# EAGLE design beemos-master (EAGLE 8.7.1)
DELETE: MF
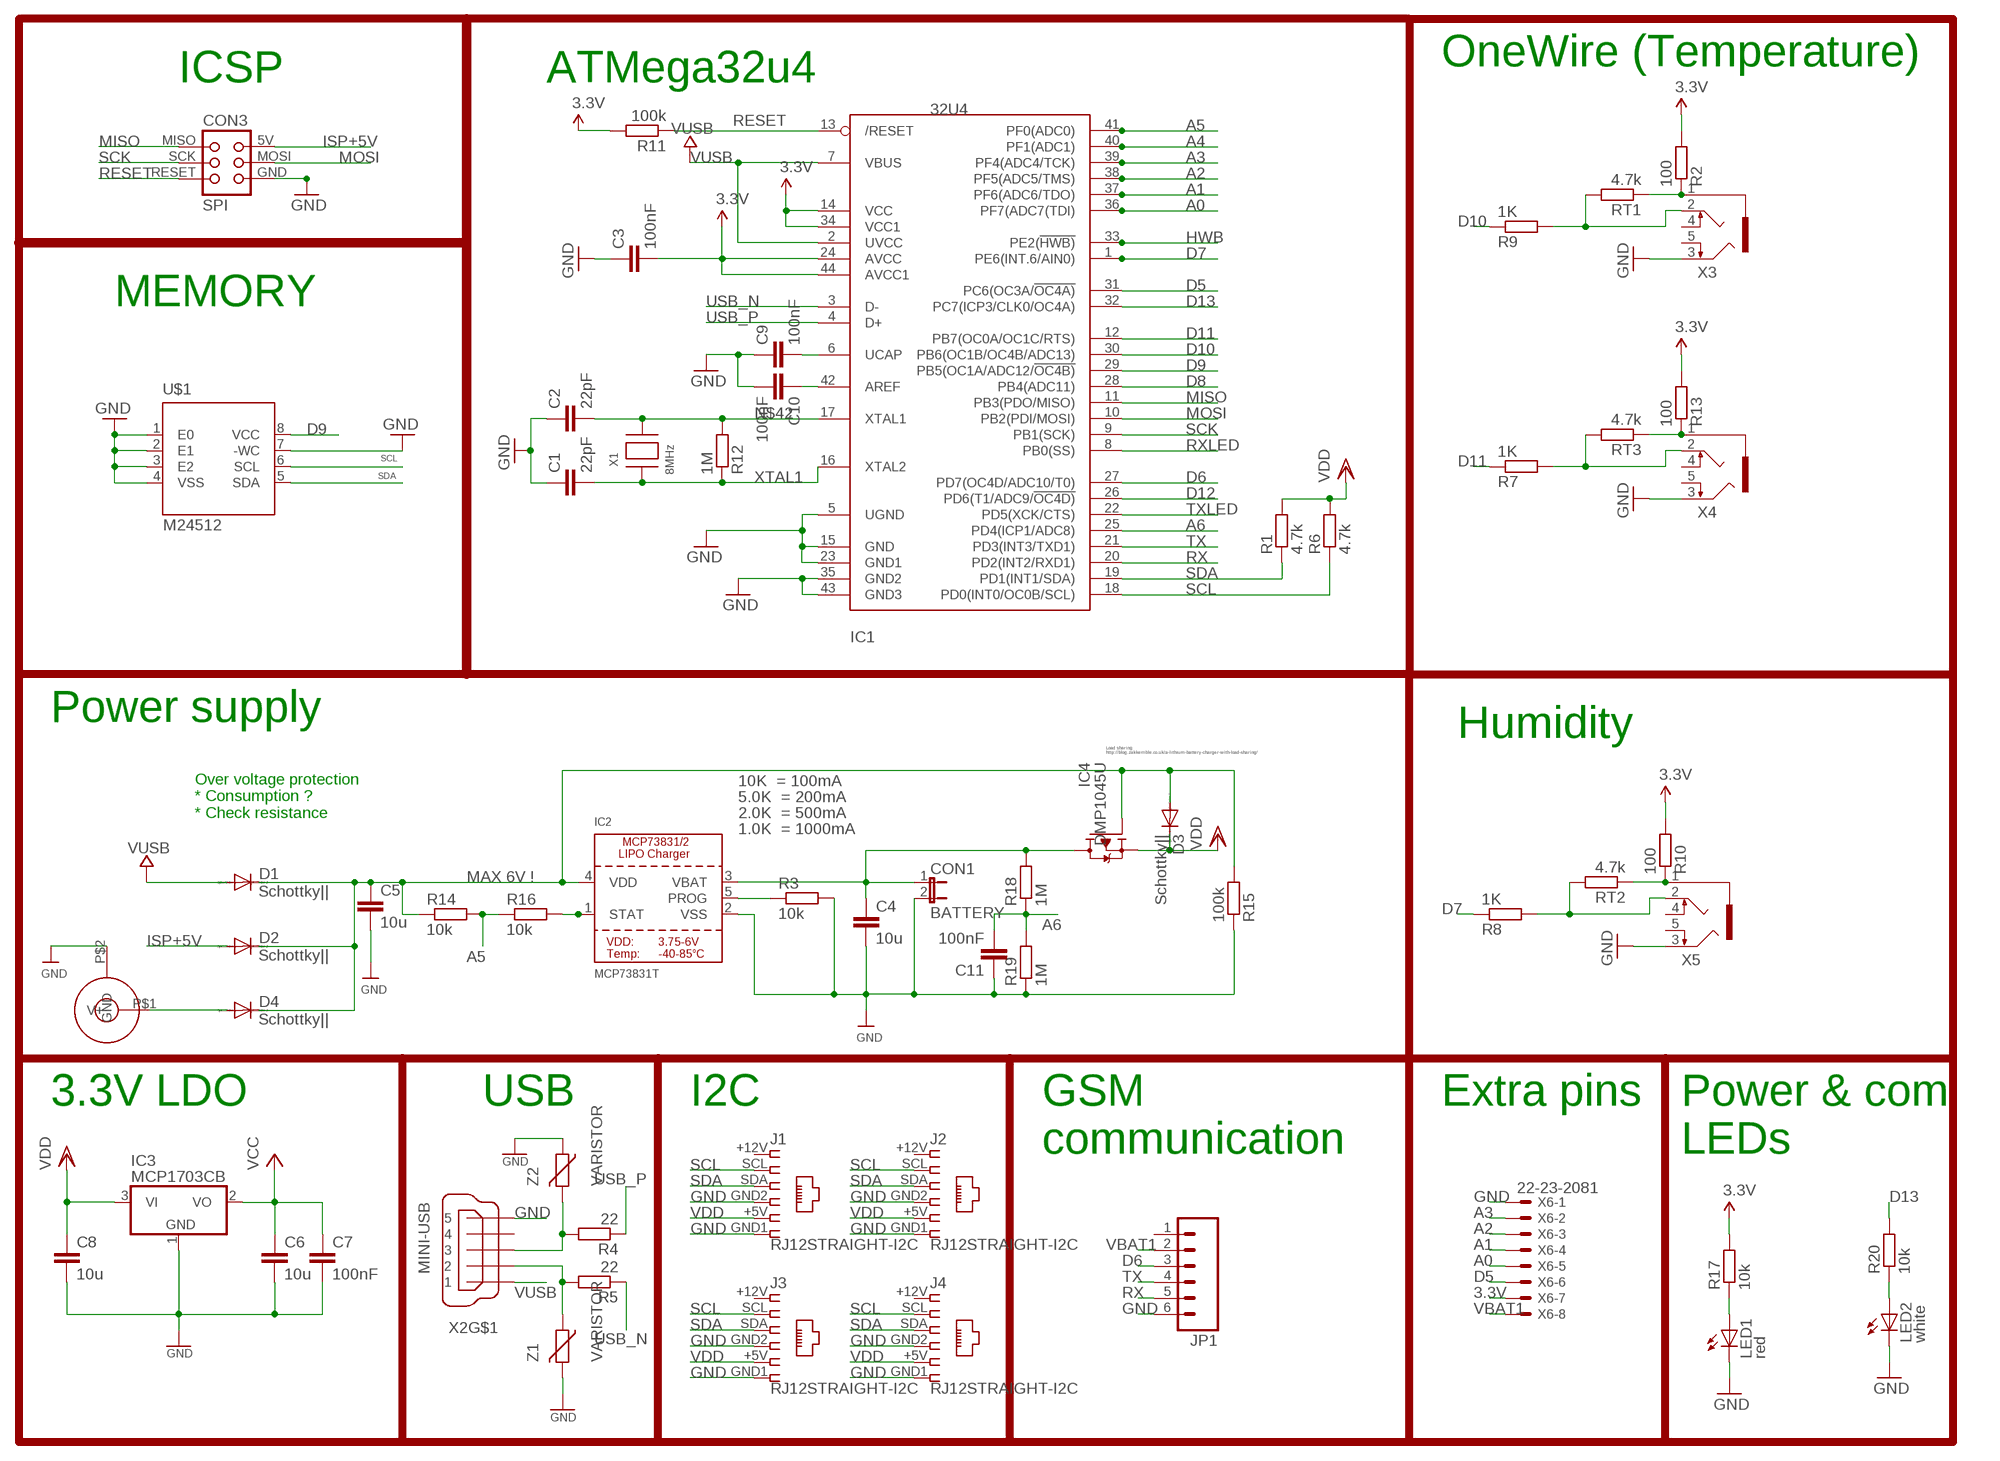
[diagram p0: schematic, sheet 1]

## Parts
C1  22pF  C-EUC0805K  [C0805K]
C2  22pF  C-EUC0805K  [C0805K]
C3  100nF  C-EUC0805K  [C0805K]
C4  10u  C-EUC0805K  [C0805K]
C5  10u  C-EUC0805K  [C0805K]
C6  10u  C-EUC0805K  [C0805K]
C7  100nF  C-EUC0805K  [C0805K]
C8  10u  C-EUC0805K  [C0805K]
C9  100nF  C-EUC0805K  [C0805K]
C10  100nF  C-EUC0805K  [C0805K]
C11  100nF  C-EUC0805K  [C0805K]
CON1  BATTERY  JP1E  [JP1]
CON2  JACK_DC_BARREL  [DC_BARREL]
CON3  SPI  TINYISPT  [TC2030-MCP-NL]
D1  Schottky||  MBR0520LT  [SOD123]
D2  Schottky||  MBR0520LT  [SOD123]
D3  Schottky||  MBR0520LT  [SOD123]
D4  Schottky||  MBR0520LT  [SOD123]
IC1  32U4  ATMEGA32U4-AU  [TQFP44]
IC2  MCP73831T  MCP73831/2  [SOT23-5]
IC3  MCP1703CB  [SOT23]
IC4  DMP1045U  TRANSISTOR_FET_TSM2301CX  [SOT-23]
J1  RJ12STRAIGHT-I2C  [RJ12-STRAIGHT-I2C]
J2  RJ12STRAIGHT-I2C  [RJ12-STRAIGHT-I2C]
J3  RJ12STRAIGHT-I2C  [RJ12-STRAIGHT-I2C]
J4  RJ12STRAIGHT-I2C  [RJ12-STRAIGHT-I2C]
JP1  M06RA  [MOLEX-1X6-RA]
LED1  red  LEDCHIP-LED0805  [CHIP-LED0805]
LED2  white  LEDCHIP-LED0805  [CHIP-LED0805]
R1  4.7k  R-EU_R0805  [R0805]
R2  100  R-EU_R0805  [R0805]
R3  10k  R-EU_R0805  [R0805]
R4  22  R-EU_R0805  [R0805]
R5  22  R-EU_R0805  [R0805]
R6  4.7k  R-EU_R0805  [R0805]
R7  1K  R-EU_R0805  [R0805]
R8  1K  R-EU_R0805  [R0805]
R9  1K  R-EU_R0805  [R0805]
R10  100  R-EU_R0805  [R0805]
R11  100k  R-EU_R0805  [R0805]
R12  1M  R-EU_R0805  [R0805]
R13  100  R-EU_R0805  [R0805]
R14  10k  R-EU_R0805  [R0805]
R15  100k  R-EU_R0805  [R0805]
R16  10k  R-EU_R0805  [R0805]
R17  10k  R-EU_R0805  [R0805]
R18  1M  R-EU_R0805  [R0805]
R19  1M  R-EU_R0805  [R0805]
R20  10k  R-EU_R0805  [R0805]
RT1  4.7k  R-EU_R0805  [R0805]
RT2  4.7k  R-EU_R0805  [R0805]
RT3  4.7k  R-EU_R0805  [R0805]
U$1  M24512  [SO8]
X1  8MHz  XTALNX6035  [NX6035]
X2  MINI-USB  MINI-USB-SCHIELD-32005-201  [32005-201]
X3  1503_09  [1503_09]
X4  1503_09  [1503_09]
X5  1503_09  [1503_09]
X6  22-23-2081  [22-23-2081]
Z1  VARISTOR  VARISTORCN0805  [CT/CN0805]
Z2  VARISTOR  VARISTORCN0805  [CT/CN0805]

## Nets
3.3V [power]: C3.2 C6.1 C7.1 IC1.14(VCC) IC1.24(AVCC) IC1.34(VCC1) IC1.44(AVCC1) IC3.2(VO) R2.2 R10.2 R11.2 R13.2 R17.2 X6.7 ; supply symbol labelled VCC
A0: IC1.36(PF7(ADC7(TDI)) X6.5
A1: IC1.37(PF6(ADC6/TDO)) X6.4
A2: IC1.38(PF5(ADC5/TMS)) X6.3
A3: IC1.39(PF4(ADC4/TCK)) X6.2
A4: IC1.40(PF1(ADC1))
A5: IC1.41(PF0(ADC0)) R14.2 R16.1
A6: C11.2 IC1.25(PD4(ICP1/ADC8)) R18.1 R19.2
AREF: C10.1 IC1.42(AREF)
D5: IC1.31(PC6(OC3A/!OC4A)) X6.6
D6: IC1.27(PD7(OC4D/ADC10/T0)) JP1.3
D7: IC1.1(PE6(INT.6/AIN0)) R8.1
D8: IC1.28(PB4(ADC11))
D9: IC1.29(PB5(OC1A/ADC12/!OC4B)) U$1.8(VCC)
D10: IC1.30(PB6(OC1B/OC4B/ADC13)) R9.1
D11: IC1.12(PB7(OC0A/OC1C/RTS)) R7.1
D12: IC1.26(PD6(T1/ADC9/!OC4D))
D13: IC1.32(PC7(ICP3/CLK0/OC4A)) R20.2
GND [power]: C1.1 C2.1 C3.1 C4.2 C5.2 C6.2 C7.2 C8.2 C9.1 C10.2 C11.1 CON1.2 CON2.P$2(GND) CON3.GND IC1.5(UGND) IC1.15(GND) IC1.23(GND1) IC1.35(GND2) IC1.43(GND3) IC2.2(VSS) IC3.1(GND) J1.GND1 J1.GND2 J2.GND1 J2.GND2 J3.GND1 J3.GND2 J4.GND1 J4.GND2 JP1.6 LED1.C LED2.C R3.2 R15.1 R19.1 U$1.1(E0) U$1.2(E1) U$1.3(E2) U$1.4(VSS) U$1.7(-WC) X2.5 X3.3 X4.3 X5.3 X6.1 Z1.2 Z2.1
HWB: IC1.33(PE2(!HWB))
ISP+5V: CON3.5V(VCC) D2.A
MISO: CON3.MISO IC1.11(PB3(PDO/MISO))
MOSI: CON3.MOSI IC1.10(PB2(PDI/MOSI))
N$1: C9.2 IC1.6(UCAP)
N$2 [power]: R7.2 RT3.2 X4.2
N$3: CON2.P$1(V+) D4.A
N$4 [power]: R13.1 RT3.1 X4.1
N$5: C5.1 D1.C D2.C D3.A D4.C IC2.4(VDD) IC4.1(G) R14.1 R15.2
N$6: IC2.5(PROG) R3.1
N$7: IC2.1(STAT) R16.2
N$8 [power]: R8.2 RT2.2 X5.2
N$9 [power]: R10.1 RT2.1 X5.1
N$10: LED1.A R17.1
N$11: LED2.A R20.1
N$14 [power]: R2.1 RT1.1 X3.1
N$21 [power]: R9.2 RT1.2 X3.2
N$42: C2.2 IC1.17(XTAL1) R12.2 X1.P$2
RESET: CON3.RESET IC1.13(/RESET) R11.1
RX: IC1.20(PD2(INT2/RXD1)) JP1.5
RXLED: IC1.8(PB0(SS))
SCK: CON3.SCK IC1.9(PB1(SCK))
SCL: IC1.18(PD0(INT0/OC0B/SCL)) J1.SCL J2.SCL J3.SCL J4.SCL R6.1 U$1.6(SCL)
SDA: IC1.19(PD1(INT1/SDA)) J1.SDA J2.SDA J3.SDA J4.SDA R1.1 U$1.5(SDA)
TX: IC1.21(PD3(INT3/TXD1)) JP1.4
TXLED: IC1.22(PD5(XCK/CTS))
USB_N: IC1.3(D-) R5.1
USB_P: IC1.4(D+) R4.1
USBC_N: R5.2 X2.2 Z1.1
USBC_P: R4.2 X2.3 Z2.2
VBAT1: C4.1 CON1.1 IC2.3(VBAT) IC4.3(D) JP1.2 R18.2 X6.8
VDD [power]: C8.1 D3.C IC3.3(VI) IC4.2(S) J1.+5V J2.+5V J3.+5V J4.+5V R1.2 R6.2
VUSB: D1.A IC1.2(UVCC) IC1.7(VBUS) X2.1
XTAL1: C1.2 IC1.16(XTAL2) R12.1 X1.P$1
Unconnected: J1.+12V J2.+12V J3.+12V J4.+12V JP1.1 X2.4 X2.M1(S:S1) X2.M2(S:S2) X2.M3(S:S3) X2.M4(S:S4) X3.4 X3.5 X4.4 X4.5 X5.4 X5.5

## Notes on the sheet
- OneWire (Temperature)
- ICSP | ATMega32u4
- MEMORY
- Power supply
- Humidity
- Load sharing:
  http://blog.zakkemble.co.uk/a-lithium-battery-charger-with-load-sharing/
- 10K  = 100mA
- 5.0K  = 200mA
- Over voltage protection
  * Consumption ?
  * Check resistance
- 2.0K  = 500mA
- 1.0K  = 1000mA
- MAX 6V !
- 3.3V LDO | USB | I2C | Extra pins
- GSM 
  communication
- Power & com 
  LEDs

## Library data of the parts
C1 C2 = rcl:C-EU: CAPACITOR, European symbol; ELECROW: C1797; LCSC: C1797; MPN: 77-VJ1206A180JXXPBC; SPICEPREFIX: C
C3 C7 C9-C11 = rcl:C-EU: CAPACITOR, European symbol; ELECROW: C49678; LCSC: C49678; MPN: 80-C1206C104K5R; SPICEPREFIX: C
C4-C6 C8 = rcl:C-EU: CAPACITOR, European symbol; ELECROW: C15850; LCSC: C15850; MPN: 77-VJ1206V106ZXQTBC; SPICEPREFIX: C
CON1 = jumper:JP1E: JUMPER
CON2 = lpatiny:JACK_DC_BARREL
CON3 = lpatiny:TINYISP: CONNECTOR
D1-D4 = diode:MBR0520LT: SCHOTTKY BARRIER RECTIFIER Source: http://onsemi.com .. MBR0520LT1-D.pdf; LCSC: C82544; MPN: 621-1N5819HW-F
IC1 = adafruit:ATMEGA32U4: http://www.ladyada.net/library/eagle; LCSC: C44854; MPN: 556-ATMEGA32U4RC-AU
IC2 = microbuilder:MCP73831/2: MCP73831/2 LIPO Charger VDD: 3.75 - 6V Temp -40 - 85°C Programmable Charge Rate: 15-500mA NOTE: STAT is a tri-state logic output on the MCP73831 and an open-drain output on the MCP73832. SOT23-5 with 4.2V output and tri-state logic on STAT = MCP73831T-2ACI/OT; LCSC: C14879; MPN: 579-MCP73831T-3ACIOT
IC3 = linear:MCP1703: 250 mA, 16V, Low Quiescent Current LDO Regulator Source: http://ww1.microchip.com/downloads/en/DeviceDoc/22049b.pdf; LCSC: C53352
IC4 = dp_devices:TRANSISTOR_FET_TSM2301CX: 20V P-Channel Enhancement Mode MOSFET; LCSC: C96613; MPN: 621-DMP1045U-7
J1-J4 = lpatiny:RJ12: CORCOM Modular RJ Jacks No Shield Source: www.tycoelectronics.com .. ENG_DS_1654001_1099_RJ_L_0507.pdf
JP1 = SparkFun:M06: Header 6 Standard 6-pin 0.1" header. Use with straight break away headers (SKU : PRT-00116), right angle break away headers (PRT-00553), swiss pins (PRT-00743), machine pins (PRT-00117), and female headers (PRT-00115). Molex polarized connector foot print use with SKU : PRT-08094 with associated crimp pins and housings. NOTES ON THE VARIANTS LOCK and LOCK_LONGPADS... This footprint was designed to help hold the alignment of a through-hole component (i.e. 6-pin header) while soldering it into place. You may notice that each hole has been shifted either up or down by 0.005 of an inch from it's more standard position (which is a perfectly straight line). This slight alteration caused the pins (the squares in the middle) to touch the edges of the holes. Because they are alternating, it causes a "brace" to hold the component in place. 0.005 has proven to be the perfect amount of "off-center" position when using our standard breakaway headers. Although looks a little odd when you look at the bare footprint, once you have a header in there, the alteration is very hard to notice. Also, if you push a header all the way into place, it is covered up entirely on the bottom side. This idea of altering the position of holes to aid alignment will be further integrated into the Sparkfun Library for other footprints. It can help hold any component with 3 or more connection pins.
LED1 LED2 = led:LED: LED OSRAM: - CHIPLED LG R971, LG N971, LY N971, LG Q971, LY Q971, LO R971, LY R971 LH N974, LH R974 LS Q976, LO Q976, LY Q976 LO Q996 - Hyper CHIPLED LW Q18S LB Q993, LB Q99A, LB R99A - SideLED LS A670, LO A670, LY A670, LG A670, LP A670 LB A673, LV A673, LT A673, LW A673 LH A674 LY A675 LS A676, LA A676, LO A676, LY A676, LW A676 LS A679, LY A679, LG A679 - Hyper Micro SIDELED® LS Y876, LA Y876, LO Y876, LY Y876 LT Y87S - SmartLED LW L88C, LW L88S LB L89C, LB L89S, LG L890 LS L89K, LO L89K, LY L89K LS L896, LA L896, LO L896, LY L896 - TOPLED LS T670, LO T670, LY T670, LG T670, LP T670 LSG T670, LSP T670, LSY T670, LOP T670, LYG T670 LG T671, LOG T671, LSG T671 LB T673, LV T673, LT T673, LW T673 LH T674 LS T676, LA T676, LO T676, LY T676, LB T676, LH T676, LSB T676, LW T676 LB T67C, LV T67C, LT T67C, LS T67K, LO T67K, LY T67K, LW E67C LS E67B, LA E67B, LO E67B, LY E67B, LB E67C, LV E67C, LT E67C LW T67C LS T679, LY T679, LG T679 LS T770, LO T770, LY T770, LG T770, LP T770 LB T773, LV T773, LT T773, LW T773 LH T774 LS E675, LA E675, LY E675, LS T675 LS T776, LA T776, LO T776, LY T776, LB T776 LHGB T686 LT T68C, LB T68C - Hyper Mini TOPLED® LB M676 - Mini TOPLED Santana® LG M470 LS M47K, LO M47K, LY M47K Source: http://www.osram.convergy.de LUXEON: - LUMILED® LXK2-PW12-R00, LXK2-PW12-S00, LXK2-PW14-U00, LXK2-PW14-V00 LXK2-PM12-R00, LXK2-PM12-S00, LXK2-PM14-U00 LXK2-PE12-Q00, LXK2-PE12-R00, LXK2-PE12-S00, LXK2-PE14-T00, LXK2-PE14-U00 LXK2-PB12-K00, LXK2-PB12-L00, LXK2-PB12-M00, LXK2-PB14-N00, LXK2-PB14-P00, LXK2-PB14-Q00 LXK2-PR12-L00, LXK2-PR12-M00, LXK2-PR14-Q00, LXK2-PR14-R00 LXK2-PD12-Q00, LXK2-PD12-R00, LXK2-PD12-S00 LXK2-PH12-R00, LXK2-PH12-S00 LXK2-PL12-P00, LXK2-PL12-Q00, LXK2-PL12-R00 Source: www.luxeon.com KINGBRIGHT: KA-3528ASYC Source: www.kingbright.com
R1 R2 R6-R10 R13 = rcl:R-EU_: RESISTOR, European symbol
R3 = rcl:R-EU_: RESISTOR, European symbol; ELECROW: C17414; LCSC: C17414
R4 = rcl:R-EU_: RESISTOR, European symbol; ELECROW: C17561; LCSC: C17561
R5 = rcl:R-EU_: RESISTOR, European symbol; ELECROW: C17561; LCSC: C17561; SPICEPREFIX: R
R11 = rcl:R-EU_: RESISTOR, European symbol; ELECROW: C17407; LCSC: C17407; MPN: RC1206FR-07100KL; SPICEPREFIX: R
R12 R18 R19 = rcl:R-EU_: RESISTOR, European symbol; ELECROW: C17514; LCSC: C17514
R14 R16 = rcl:R-EU_: RESISTOR, European symbol; ELECROW: C17513; LCSC: C17513
R15 = rcl:R-EU_: RESISTOR, European symbol; ELECROW: C17407; LCSC: C17407; MPN: RC1206FR-07100KL
R17 R20 = rcl:R-EU_: RESISTOR, European symbol; SPICEPREFIX: R
RT1-RT3 = resistor:R-EU_: RESISTOR, European symbol
U$1 = lpatiny:M24512
X1 = lpatiny:XTAL: Low cost SMT crystals, no capacitors included http://www.ladyada.net/library/eagle; LCSC: C122522; MPN: 729-F60800010
X2 = con-cypressindustries:MINI-USB-SCHIELD-: MINI USB-B Conector Source: www.cypressindustries.com; LCSC: C46391; MPN: 649-10033526-N3212LF
X3-X5 = con-lumberg:1503_09: Jack connectors according to JISC 6560, 3.5 mm Klinkeneinbaukupplung nach JISC 6560, 3,5 mm, 3-polig/ stereo, abgewinkelte Ausführung, mit 2 Öffnern und Lötaugen, für Leiterplatten Rückseitenmontage Source: http://www.lumberg.com/Produkte/PDFs/1503_09.pdf; OC_FARNELL: 1243244; OC_NEWARK: unknown
X6 = con-molex:22-23-2081: .100" (2.54mm) Center Header - 8 Pin; MF: MOLEX; MPN: 22-23-2081; OC_FARNELL: 1756826; OC_NEWARK: 01C7592
Z1 Z2 = varistor:VARISTOR: VARISTOR; LCSC: C79709

## Net classes
0 default: width 0.203 mm, clearance 0.25 mm
1 power: width 0.203 mm, drill 0.305 mm, clearance 0.25 mm
2 VIN: width 0.406 mm, clearance 0.25 mm
3 fine: width 0.406 mm, clearance 0.25 mm
4 aref: width 0.406 mm, clearance 0.25 mm

## Board
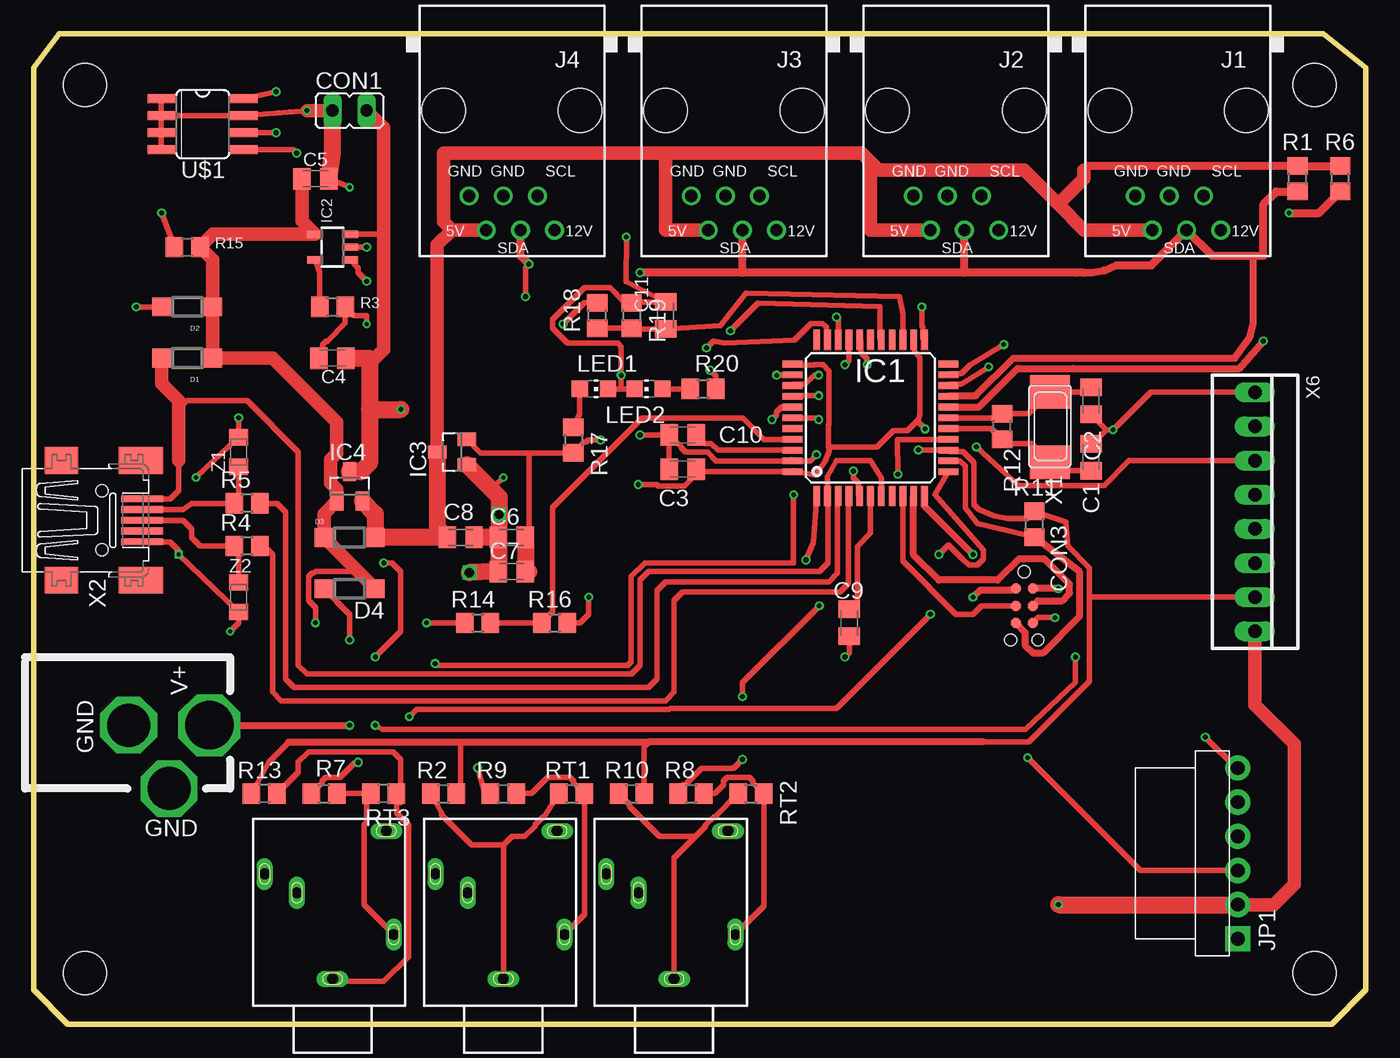
[diagram p1: board, top side]
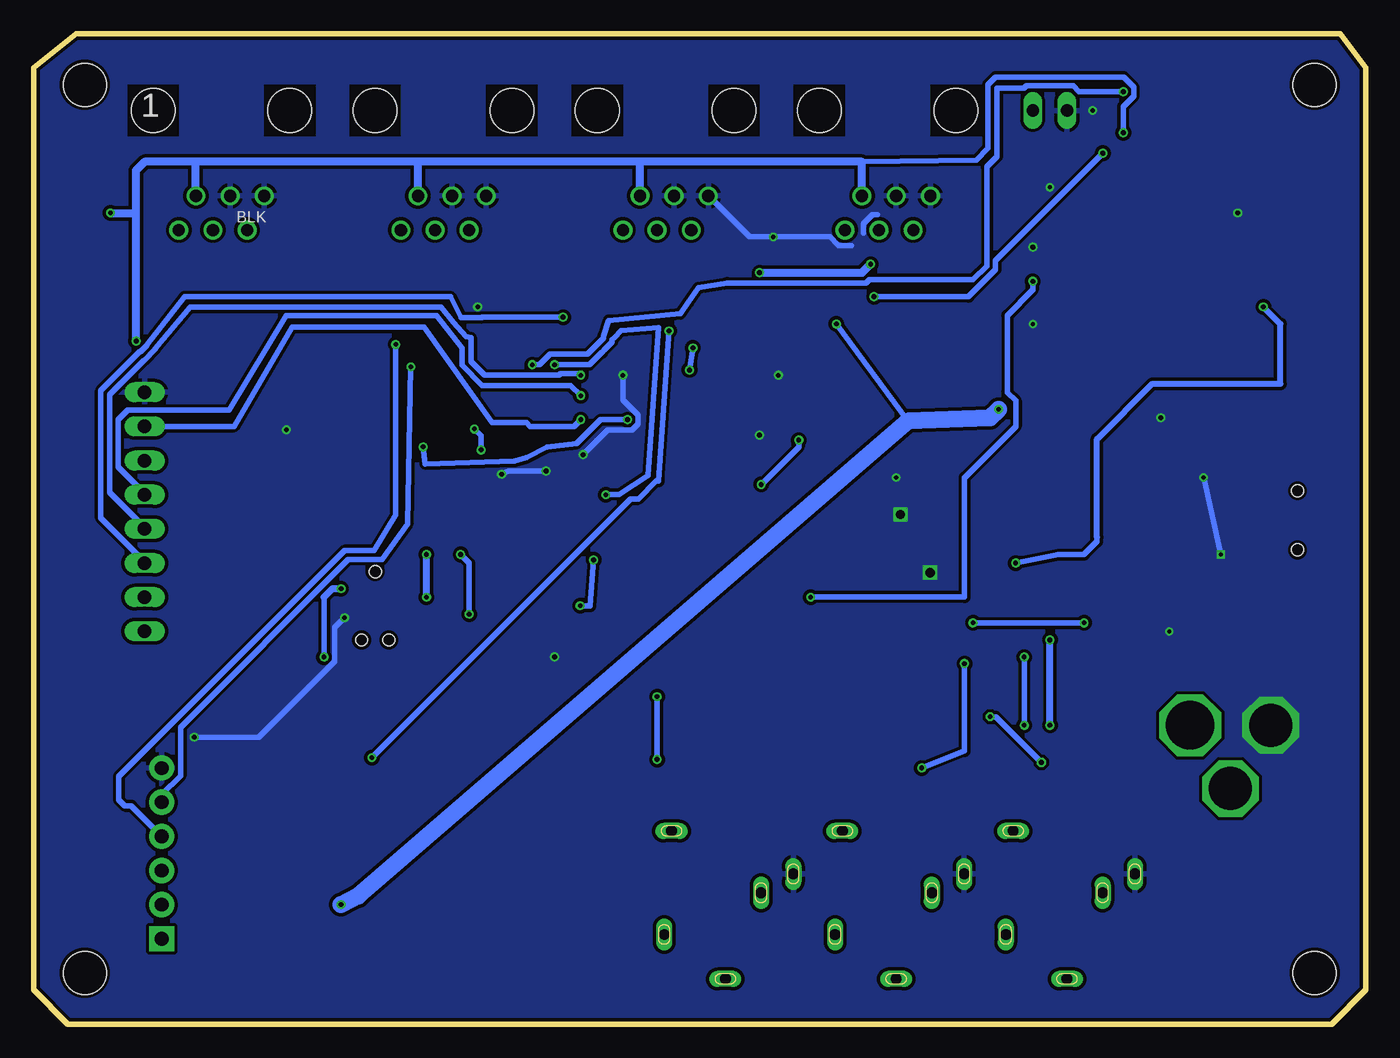
[diagram p2: board, bottom side, seen from below]

Size 99.06 x 73.66 mm. Coordinates in mm from the lower left corner, seen from the top.
Outline: 99.06,71.12 99.06,2.54 96.52,0 2.54,0 0,2.54 0,71.12 1.91,73.66 95.89,73.66 99.06,71.12
Copper layers (1*16): Top 0.035mm / dielectric 0.2mm / Bottom 0.035mm
Design rules "SeeedStudio_DRU_no_angle_20130527 *": minimum track width 6mil, minimum drill 12mil, track to track 6mil, track to pad 6mil, pad to pad 6mil, via to via 6mil, smd to smd 0mil, copper to edge 10mil, drill to drill 10mil, minimum pad ring 6mil, minimum via ring 6mil, stop-mask expansion 2mil, vias tented up to drill 25mil, thermal gap 10mil
Holes 3.2 mm at 95.25,69.85 95.25,3.81 3.81,69.85 3.81,3.81

### Footprints (pad centres in the part's own frame; a part is rotated, then mirrored left to right if it is on the bottom)
C0805K = smd 1.3 x 1.6: 1 -1,0; 2 1,0
JP1 = drill 0.914 long: 1 0,-1.27; 2 0,1.27
DC_BARREL = drill 3.6 pad 4.5 octagon: P$1 0,13.7 | drill 3.2 pad 4.064 octagon: P$2 0,7.7; P$3 4.7,10.7
TC2030-MCP-NL = smd 0.787 x 0.787: 5V 1.27,0.635; GND 3.81,0.635; MISO 1.27,-0.635; MOSI 2.54,0.635; RESET 3.81,-0.635; SCK 2.54,-0.635 | hole 0.889: 0,0; 5.08,-1.016; 5.08,1.016
SOD123 = smd 1.4 x 1.4: A 1.9,0; C -1.9,0
TQFP44 = smd 1.5 x 0.5: 1 -5.8,4; 2 -5.8,3.2; 3 -5.8,2.4; 4 -5.8,1.6; 5 -5.8,0.8; 6 -5.8,0; 7 -5.8,-0.8; 8 -5.8,-1.6; 9 -5.8,-2.4; 10 -5.8,-3.2; 11 -5.8,-4; 23 5.8,-4; 24 5.8,-3.2; 25 5.8,-2.4; 26 5.8,-1.6; 27 5.8,-0.8; 28 5.8,0; 29 5.8,0.8; 30 5.8,1.6; 31 5.8,2.4; 32 5.8,3.2; 33 5.8,4 | smd 0.5 x 1.5: 12 -4,-5.8; 13 -3.2,-5.8; 14 -2.4,-5.8; 15 -1.6,-5.8; 16 -0.8,-5.8; 17 0,-5.8; 18 0.8,-5.8; 19 1.6,-5.8; 20 2.4,-5.8; 21 3.2,-5.8; 22 4,-5.8; 34 4,5.8; 35 3.2,5.8; 36 2.4,5.8; 37 1.6,5.8; 38 0.8,5.8; 39 0,5.8; 40 -0.8,5.8; 41 -1.6,5.8; 42 -2.4,5.8; 43 -3.2,5.8; 44 -4,5.8
SOT23-5 = smd 0.55 x 1.2: 1 -0.95,-1.3; 2 0,-1.3; 3 0.95,-1.3; 4 0.95,1.3; 5 -0.95,1.3
SOT23 = smd 1 x 1.4: 1 -0.95,-1.1; 2 0.95,-1.1; 3 0,1.1
SOT-23 = smd 1 x 1.4: 1 -0.95,-1.1; 2 0.95,-1.1; 3 0,1.1
RJ12-STRAIGHT-I2C = drill 0.9 pad 1.4: +5V 1.905,8.89; +12V -3.175,8.89; GND1 3.175,6.35; GND2 0.635,6.35; SCL -1.905,6.35; SDA -0.635,8.89 | hole 3.251: -5.08,0; 5.08,0
MOLEX-1X6-RA = drill 1.016 pad 1.88 square: 1 0,0 | drill 1.016 pad 1.88: 2 2.54,0; 3 5.08,0; 4 7.62,0; 5 10.16,0; 6 12.7,0
CHIP-LED0805 = smd 1.2 x 1.2: A 0,-1.05; C 0,1.05
R0805 = smd 1.3 x 1.5: 1 -0.95,0; 2 0.95,0
SO8 = smd 0.66 x 2.032: 1 -3.81,-3.073; 2 -2.54,-3.073; 3 -1.27,-3.073; 4 0,-3.073; 5 0,3.073; 6 -1.27,3.073; 7 -2.54,3.073; 8 -3.81,3.073
NX6035 = smd 2.5 x 3: P$1 2.665,0; P$2 -2.565,0
32005-201 = smd 3.1 x 0.5: 1 3,1.6; 2 3,0.8; 3 3,0; 4 3,-0.8; 5 3,-1.6 | smd 2.5 x 2: M1 -3,-4.45; M2 -3,4.45 | smd 3.3 x 2: M3 2.9,4.45; M4 2.9,-4.45 | hole 0.9: 0,2.2; 0,-2.2
1503_09 = drill 0.8 pad 1.2 long: 1 0,-2.1; 2 -4.55,-5.4; 3 5.05,-9.9; 4 -4,-13.1; 5 2.65,-8.5
22-23-2081 = drill 1 long: 1 -8.89,0; 2 -6.35,0; 3 -3.81,0; 4 -1.27,0; 5 1.27,0; 6 3.81,0; 7 6.35,0; 8 8.89,0
CT/CN0805 = smd 1.2 x 1.4: 1 -1.1,0; 2 1.1,0

### Placement (x,y rotation side)
C1  78.61,42.16 270 top
C2  78.61,46.35 90 top
C3  48.26,41.27 0 top
C4  22.23,49.53 180 top
C5  20.95,62.87 0 top
C6  35.56,36.2 180 top
C7  35.56,33.66 180 top
C8  31.75,36.2 0 top
C9  60.64,29.84 90 top
C10  48.26,43.81 180 top
C11  46.99,52.7 270 top
CON1  23.5,67.94 90 top
CON2  -0.64,22.23 270 top
CON3  73.66,33.66 270 top
D1  11.43,49.53 180 top
D2  11.43,53.34 180 top
D3  23.5,36.2 180 top
D4  23.5,32.38 180 top
IC1  62.23,45.09 90 top
IC2  22.23,57.78 90 top
IC3  31.11,42.55 90 top
IC4  23.5,40.01 0 top
J1  85.09,67.94 180 top
J2  68.58,67.94 180 top
J3  52.07,67.94 180 top
J4  35.56,67.94 180 top
JP1  89.53,6.35 90 top
LED1  41.66,47.24 270 top
LED2  45.72,47.24 90 top
R1  93.98,62.87 90 top
R2  30.48,17.14 0 top
R3  22.23,53.34 0 top
R4  15.88,35.56 180 top
R5  15.88,38.73 180 top
R6  97.16,62.87 90 top
R7  21.59,17.14 0 top
R8  48.9,17.14 0 top
R9  34.92,17.14 0 top
R10  44.45,17.14 0 top
R11  74.42,37.17 90 top
R12  72.01,44.45 90 top
R13  17.14,17.14 180 top
R14  33.02,29.84 0 top
R15  11.43,57.78 0 top
R16  38.73,29.84 0 top
R17  40.13,43.43 270 top
R18  41.91,52.7 90 top
R19  44.45,52.7 270 top
R20  49.78,47.24 0 top
RT1  40.01,17.14 0 top
RT2  53.34,17.14 0 top
RT3  26.04,17.14 180 top
U$1  12.57,65.02 270 top
X1  75.56,44.45 270 top
X2  5.08,37.47 0 top
X3  34.92,1.27 180 top
X4  22.23,1.27 180 top
X5  47.62,1.27 180 top
X6  90.81,38.1 270 top
Z1  15.24,42.55 90 top
Z2  15.24,31.75 90 top

### Tracks (layer width: path | path; a pad name or v marks a point on that pad's centre or on a via)
3.3V  (via drill 0.35)
  Top 0.406: 56.64,41.09 IC1.44 49.45,41.09 | 56.64,41.09 58.08,40.83 58.84,41.83 59.18,42.67 59.1,42.93 | R13.2 17.46,19.47 18.95,20.95 | R2.2 31.75,16.83 31.75,20.95 | R10.2 45.4,20.64 45.72,20.95 | 70.61,21.01 74,21.01 78.5,25.5 78.5,31.75 | 78.5,31.75 78.5,33.94 76.88,35.55 76.74,37.33 R11.2 73.89,37.59 72.39,37.59 71.44,37.78 70.29,38.29 69.92,38.66 69.92,41.78 69.11,42.59 68.13,42.59 IC1.14 65.81,42.69 v65.79,42.7 | X6.7 78.5,31.75 | 65.78,44.96 65.91,45.35 65.91,49.56 65.48,50 65.48,50.84 IC1.24 | 59.1,42.93 59.1,44.58 59.15,44.63 59.15,48.58 58.69,49.04 58.05,49.04 58.03,49.02 57.15,49.02 57.09,49.09 IC1.34 | 36.83,42.48 33.23,42.48 IC3.2 | 36.83,42.48 36.83,36.47 C6.1 | 56.55,41.18 56.64,41.09 | 49.45,41.09 C3.2 | 36.83,42.48 R17.2 40.93,43.28 41.07,43.28 41.22,43.43 v42.16,43.43 | v44.96,40.13 46.31,40.13 46.42,40.02 48.39,40.02 49.45,41.09 | v66.29,44.27 65.78,44.78 65.78,44.96 | 59.1,42.93 62.72,42.93 63.94,44.15 64.97,44.15 65.78,44.96
  Top 0.508: 18.95,20.95 31.75,20.95 45.72,20.95 45.77,21.01 70.61,21.01
  Top 1.27: 36.83,33.66 C7.1 C6.1
  Bottom 0.406: v42.16,43.43 42.16,42.93 v44.96,40.13 | v65.79,42.7 65.79,43.76 v66.29,44.27
A0  (via drill 0.35)
  Top 0.406: IC1.36 56.53,47.58 57.37,47.58 58.05,48.26 v58.37,48.26
  Bottom 0.406: X6.5 90.81,36.92 93.42,39.53 93.42,46.83 90.88,49.36 90.84,49.36 90,50.2 90,50.24 87.42,53.34 68.75,53.34 67.82,52.16 66.89,51.14 66.55,51.05 66.55,49.28 65.53,48.26 60,48.26 59.88,48.38 58.49,48.38 v58.37,48.26
A1  (via drill 0.35)
  Top 0.406: v58.37,46.74 56.48,46.74 IC1.37
  Bottom 0.406: X6.4 90.81,39.46 92.76,41.41 92.76,44.95 92.05,45.65 84.52,45.65 80.28,52.68 69.09,52.68 67.2,50.29 67.2,49 65.7,47.5 59.13,47.5 v58.37,46.74
A2  (via drill 0.35)
  Top 0.406: v54.9,44.96 55.23,45.28 55.23,45.52 55.59,45.88 IC1.38 | X6.3 81.45,41.91 79.6,40.06 73.22,40.06 v70.1,42.93
  Bottom 0.406: v70.1,42.93 69.94,41.66 63.31,41.89 62.41,42.15 60.87,42.93 58.67,43.18 56.9,44.96 v54.9,44.96
A3  (via drill 0.35)
  Top 0.406: v58.37,44.96 58.24,45.09 IC1.39
  Bottom 0.406: v58.37,44.96 58.88,44.45 62.14,44.45 62.41,44.72 64.95,44.72 70.03,51.84 79.83,51.84 84.16,44.45 X6.2
A4
  Top 0.406: 56.43,44.32 IC1.40
A5
  Top 0.406: 48.28,45.07 48.26,45.09 | R14.2 R16.1 38.58,30.64 38.58,38.42 45.23,45.07 48.28,45.07 | 48.28,45.07 52.74,45.07 54.32,43.48 IC1.41
A6
  Top 0.406: IC1.25 64.63,52.84 64.39,54.1 52.96,54.36 51.07,51.96 C11.2 44.5,51.7 R19.2 | R18.1 R19.2 | R19.2 44.5,51.7
AREF
  Top 0.406: C10.1 49.89,43.19 50.37,43.19 50.87,42.69 IC1.42
D5  (via drill 0.35)
  Top 0.406: 59.82,50.88 IC1.31 59.83,52.44 v59.69,52.58
  Bottom 0.406: v59.69,52.58 65.7,52.58 65.72,52.56 67.29,52.56 68.07,54.1 87.83,54.1 90.66,50.52 90.66,50.48 91.12,50.02 91.16,50.02 94.07,47.1 94.07,37.64 90.81,34.38 X6.6
D6  (via drill 0.35)
  Top 0.406: IC1.27 62.93,50.98 62.93,51.82 62.92,53.36 53.87,53.61 v51.82,51.56 | JP1.3 82.3,11.43 v73.91,19.81
  Bottom 0.406: v51.82,51.56 52.58,40.39 52.77,40.39 54.1,39.06 54.66,39.06 v73.91,19.81
D7  (via drill 0.35)
  Top 0.406: IC1.1 57.98,35.84 v57.42,34.52 | v58.42,31.11 52.7,25.4 v52.7,24.35 | v52.7,19.68 52.02,19 49.66,19 48.44,17.78 48.26,17.78 47.95,17.46 R8.1
  Bottom 0.406: v57.42,34.52 57.68,31.09 v58.42,31.11 | v52.7,24.35 v52.7,19.68
D9  (via drill 0.35)
  Top 0.406: IC1.29 61.53,50.79 61.53,49.95 61.98,49.5 v61.98,49.04 | v18.03,69.34 U$1.8
  Bottom 0.406: v61.98,49.04 61.43,49.04 60.65,49.82 57.88,49.82 56.69,51 56.69,51.17 56.3,52.32 50.97,52.83 50.4,53.65 49.64,54.76 47.5,55.12 45.43,55.12 45.41,55.1 37.17,55.1 36.9,55.37 29.21,55.37 28.19,56.39 28.19,63.75 27.43,64.52 27.43,69.6 25.41,69.6 25.24,69.77 21.75,69.77 21.32,69.34 v18.03,69.34
D10  (via drill 0.35)
  Top 0.406: IC1.30 60.63,49.35 v60.33,49.04 | v56.52,39.37 56.52,34.31 45.45,34.31 44.43,33.29 44.43,26.94 44.18,26.69 29.84,26.69 v29.84,26.82 | v33.02,19.05 33.66,16.83 R9.1
  Bottom 0.406: v29.84,26.82 29.84,20.32 v33.02,19.05 | v60.33,49.04 57.73,49.04 56.84,49.93 56.78,49.94 56.65,50.12 56.04,50.73 56.04,50.9 55.88,51.05 55.39,51.56 52.6,51.82 53.36,40.79 55.54,39.37 v56.52,39.37
D11  (via drill 0.35)
  Top 0.406: v67.31,34.92 68.03,35.65 69.07,34.61 69.07,34.6 69.53,34.14 70.17,34.14 70.63,34.6 70.63,35.25 67.01,39.37 IC1.12 | v66.67,30.48 59.69,23.5 47.36,23.5 47.26,23.4 28.48,23.4 v27.94,22.86 | R7.1 21.44,17.94 21.44,18.08 21.7,18.35 22.79,18.35 23.91,19.47 v24.13,19.47
  Bottom 0.406: v67.31,34.92 66.67,34.29 v66.67,30.48 | v24.13,19.47 27.52,22.86 v27.94,22.86
D13  (via drill 0.35)
  Top 0.406: IC1.32 58.93,50.98 58.93,51.82 58.67,52.09 57.79,52.09 56.59,50.88 51.39,50.63 50.55,50.8 v50.04,50.29 | v50.29,48.64 50.73,48.2 R20.2
  Bottom 0.406: v50.04,50.29 v50.29,48.64
GND  (via drill 0.3, 0.35, 0.7)
  Top 0.406: 34.29,36.2 C6.2 | C7.2 34.29,33.66 | X2.5 10.16,35.87 10.79,35.23 v10.79,34.92 Z2.1 15.24,29.84 v14.61,29.21 | 66.2,50.88 IC1.23 66.13,50.98 66.13,51.82 66.04,51.92 v66.04,53.34 | IC2.2 v24.77,57.78 | v24.77,52.07 24.77,52.7 23.81,52.7 R3.2 23.18,52.12 21.84,50.78 21.75,50.78 21.49,50.52 21.49,50.43 C4.2 | v34.92,40.64 34.37,40.08 33.73,40.08 | v12.06,40.64 Z1.2 v15.24,45.09 | C5.2 v23.5,62.23 | IC1.43 56.34,41.98 | C10.2 v45.09,43.81 | R15.1 v9.53,60.33 | IC1.35 55.27,48.28 v55.24,48.26 | C11.1 44.5,53.7 R19.1 | C11.1 44.05,55.23 v44.07,58.55 | IC1.43 50.74,41.88 50.1,42.53 48.46,42.53 48.16,42.83 48.16,42.92 C10.2 | C10.2 C3.1 | C2.1 79.77,44.2 | 79.77,44.2 v80.26,44.2 83.06,46.99 X6.1 | C1.1 78.74,43.16 79.77,44.2 | IC1.15 64.21,43.48 v64.26,40.89 | U$1.1 U$1.2 | U$1.2 U$1.3 U$1.4 | U$1.2 U$1.7 v20.32,67.94 | LED2.C 43.69,47.24 | 43.69,47.24 LED1.C | 43.69,47.24 v43.69,48.26 43.69,50.39 43.44,50.65 39.68,50.65 38.59,51.75 38.59,52.39 40.95,54.76 42.85,54.76 43.9,53.7 C11.1 | C9.1 60.64,27.62 v60.33,27.3 | CON3.GND 74.68,30.23 v75.95,30.23 | IC1.5 61.33,39.38 61.33,40.22 60.96,40.6 v60.96,41.13 | v58.21,42.35 57.75,41.88 IC1.43 | v87.12,21.34 89.41,19.05 JP1.6
  Top 1.016: CON1.2 v20.32,67.94
  Top 1.27: C6.2 v34.61,37.9 34.61,39.2 33.73,40.08 IC3.1 | C6.2 C8.2 | C6.2 C7.2 | 34.29,33.66 v32.4,33.59 | C5.2 22.23,64.77 CON1.2
  Bottom 0.406: v12.06,40.64 v10.79,34.92 | v60.96,41.13 63.73,41.13 v64.26,40.89 | v75.95,30.23 76.69,29.48 76.69,26.98 82.33,21.34 v87.12,21.34 | J3.GND1 45.85,58.55 v44.07,58.55 39.86,58.55 39.21,57.9 38.26,57.9 | 36.31,60.21 36.67,60.21 37.35,59.53 37.35,58.81 | v55.24,48.26 55.24,46.41 54.12,45.28 54.12,44.63 54.58,44.18 56.38,44.18 v58.21,42.35
  pour Bottom: 99.06,71.12 99.06,2.54 96.52,0 2.54,0 0,2.54 0,71.12 1.91,73.66 95.89,73.66
HWB
  Top 0.406: 58.23,50.99 IC1.33
ISP+5V  (via drill 0.35)
  Top 0.406: v77.47,27.3 77.47,25.4 73.73,21.92 25.96,21.92 v25.4,22.23 | v7.62,53.34 D2.A | v25.4,27.3 27.3,29.21 27.3,33.66 26.67,34.29 v26.04,34.29
  Top 0.508: v76.2,32.38 CON3.5V
  Bottom 0.406: v25.4,22.23 v25.4,27.3 | v26.04,34.29 22.86,34.92 20.95,34.92 20,35.88 20,36.2 20,36.51 | 77.47,31.75 v77.47,27.3 | 6.35,52.07 v7.62,53.34
  Bottom 0.457: 20,36.2 20,43.47 arc45 19.98,43.52 15.88,47.62 6.35,47.62 6.35,52.07
  Bottom 0.508: 77.47,31.75 76.83,32.38 v76.2,32.38
MISO  (via drill 0.35)
  Top 0.508: CON3.MISO 72.83,32.38 72.7,32.26 70.36,32.26 v69.85,31.75 | v69.85,34.92 66.23,38.55 IC1.11
  Bottom 0.508: v69.85,31.75 v69.85,34.92
MOSI
  Top 0.508: IC1.10 65.43,34.9 67.31,33.02 71.68,33.02 73.27,34.61 75.15,34.61 77.03,32.73 77.03,32.04 76.48,31.49 74.67,31.49 CON3.MOSI
N$1
  Top 0.406: IC1.6 62.23,36.51 61.25,35.52 61.25,31.45 C9.2
N$2
  Top 0.406: R7.2 24.77,17.14 | 24.77,17.14 RT3.2 | 24.77,17.14 24.77,15 24.57,14.81 24.57,8.87 X4.2
N$3  (via drill 0.35)
  Top 0.406: D4.A 23.47,30.51 arc-45 23.5,30.45 v23.5,28.57
  Top 0.508: CON2.P$1 v23.5,22.23
  Bottom 0.508: v23.5,22.23 v23.5,28.57
N$4
  Top 0.406: R13.1 19.68,18.73 19.68,19.5 20.44,20.25 26.74,20.25 27.3,19.68 27.3,16.82 | 27.3,16.51 27.3,16.82 | 27.3,16.82 RT3.1 26.98,15.7 27.88,14.81 27.88,5.02 26.04,3.17 22.42,3.17 X4.1
N$5  (via drill 0.35)
  Top 0.406: R14.1 v29.21,29.84 | v20.95,29.84 20.95,30.98 20.44,31.5 20.44,33.27 20.71,33.54 20.84,33.54 20.95,33.66 22.83,33.66 arc45 22.88,33.68 24.13,33.66
  Top 1.016: D4.C 24.13,33.66 D3.A 21.59,37.95 IC4.1 22.55,39.78 22.1,40.23 22.1,41.98 22.55,42.43 22.55,44.77 17.78,49.53 D1.C D2.C 13.33,56.84 R15.2 13.33,58.73 IC2.4 19.95,59.7 C5.1
  Bottom 0.406: v29.21,29.84 v20.95,29.84
N$6
  Top 0.406: IC2.5 21.27,55.91 R3.1
N$7  (via drill 0.35)
  Top 0.406: IC2.1 24.11,56.25 arc-45 24.13,56.2 24.13,55.88 v24.77,55.24 | v41.27,31.75 41.27,30.48 40.66,29.87 arc-45 40.61,29.84 R16.2
  Bottom 0.406: v24.77,55.24 24.77,54.64 arc45 24.79,54.59 26.67,52.7 26.67,47.02 arc-45 26.65,46.97 26.04,46.35 26.04,44.45 29.82,40.66 arc-45 29.84,40.61 29.84,31.75 v41.27,31.75
N$8
  Top 0.406: X5.2 54.29,8.79 RT2.2 53.49,17.94 53.49,18.08 53.23,18.35 51.55,18.35 51.29,18.08 51.29,17.78 50.65,17.14 R8.2
N$9
  Top 0.406: RT2.1 50.67,15.42 50.59,15.42 49.97,14.81 49.97,14.73 49.22,13.97 | R10.1 44.3,16.35 44.3,16.21 46.53,13.97 49.22,13.97 | 49.22,13.97 47.62,12.38 X5.1
N$10
  Top 0.406: LED1.A 40.61,45.37 R17.1
N$11
  Top 0.406: R20.1 LED2.A
N$14
  Top 0.406: RT1.1 37.97,15.42 37.89,15.42 37.27,14.81 37.27,14.73 36.52,13.97 35.56,13.97 34.92,13.34 | 34.92,13.34 X3.1 | R2.1 30.33,15.71 30.33,15.57 32.56,13.34 34.92,13.34
N$21
  Top 0.406: X3.2 40.95,8.15 RT1.2 40.16,17.94 40.16,18.08 39.89,18.35 38.22,18.35 37.01,17.14 R9.2
N$42
  Top 0.406: IC1.17 71.69,45.09 R12.2 73.95,45.4 X1.P$2 78.27,47.02 C2.2
RESET
  Top 0.406: IC1.13 68.89,41.88 69.27,41.5 69.27,38.38 70.16,37.24 R11.1
  Top 0.508: CON3.RESET 73.72,29.15 73.72,28.18 74.28,27.62 75.07,27.62 77.79,30.34 77.79,33.62 R11.1
RX  (via drill 0.35)
  Top 0.406: IC1.20 68.13,47.58 68.97,47.58 68.99,47.61 v71.01,48.88
  Bottom 0.406: v71.01,48.88 71.27,37.19 73.14,34.56 75.66,34.56 88.14,22.08 88.14,18.47 89.53,17.08 JP1.5
SCK
  Top 0.406: IC1.9 64.63,34.43 68.58,30.48 69.85,30.48 70.48,31.11 CON3.SCK
SCL  (via drill 0.35)
  Top 0.406: U$1.6 v18.03,66.29
  Top 0.508: IC1.18 70.27,45.88 73.15,48.77 77.27,48.77 77.28,48.77 89.66,48.77 v91.44,50.8
  Top 0.61: v93.34,60.33 95.56,60.33 R6.1
  Bottom 0.406: v18.03,66.29 18.03,68.24 17.25,69.02 17.25,69.67 18.01,70.43 27.53,70.43 28.09,69.87 28.09,65.13 28.96,64.26 37.47,64.14
  Bottom 0.61: v91.44,50.8 91.44,60.33 | 91.44,60.33 91.44,63.5 90.81,64.14 87,64.14 | 53.98,64.14 37.47,64.14 J4.SCL | 53.98,64.14 70.48,64.14 | 70.48,64.14 87,64.14 | J3.SCL 53.98,64.14 | J2.SCL 70.48,64.14 | J1.SCL 87,64.14 | v93.34,60.33 91.44,60.33
SDA  (via drill 0.35)
  Top 0.406: U$1.5 19.3,65.02 v19.56,64.77 | v36.58,54.1 36.58,56.26 v36.83,56.52
  Top 0.508: IC1.19 68.08,46.73 70.04,46.73 72.84,49.53 77.59,49.53 89.32,49.53 90.42,51.05 90.68,52.07 90.68,57.15
  Top 0.559: 77.47,55.88 78.74,55.88 79.6,56.04
  Top 0.61: v36.83,56.52 36.2,57.15 J4.SDA | 78.11,55.88 77.47,55.88 69.22,55.88 | 69.22,55.88 52.7,55.88 | 52.7,55.88 v45.09,55.88 | 52.7,55.88 J3.SDA | 69.22,55.88 J2.SDA | R1.1 92.39,61.91 91.44,60.96 91.44,57.15 90.68,57.15 87.63,57.15 J1.SDA 83.11,56.44 80.51,56.44 79.6,56.04
  Bottom 0.406: v19.56,64.77 27.54,56.79 27.54,56.12 29.55,54.1 v36.58,54.1
  Bottom 0.61: v45.09,55.88 37.47,55.88 v36.83,56.52
TX  (via drill 0.35)
  Top 0.406: IC1.21 68.13,48.38 68.97,48.38 69.61,49.02 v72.14,50.55
  Bottom 0.406: v72.14,50.55 72.14,37.85 73.75,35.21 75.94,35.21 92.73,18.42 92.73,16.7 92.27,16.24 91.8,16.24 JP1.4
USB_N
  Top 0.406: IC1.3 59.77,39.28 59.77,33.53 59.13,32.9 46.99,32.9 46.35,32.26 46.35,25.68 45.72,25.04 19.37,25.04 18.73,25.68 18.73,38.1 18.1,38.73 R5.1
USB_P
  Top 0.406: R4.1 17.14,35.56 17.78,34.92 17.78,24.69 18.41,24.05 46.99,24.05 47.62,24.69 47.62,31.51 48.26,32.14 59.96,32.14 60.59,32.78 60.59,39.28 IC1.4
USBC_N
  Top 0.406: X2.2 11.12,38.27 11.76,38.73 R5.2 15.24,39.05 Z1.1
USBC_P
  Top 0.406: X2.3 11.12,37.47 11.76,36.83 11.76,36.2 12.39,35.56 R4.2 15.24,35.24 Z2.2
VBAT1  (via drill 0.35)
  Top 0.406: IC2.3 26.04,58.73 26.04,61.59 | R18.2 40.95,53.66 v39.37,52.07
  Top 1.016: CON1.1 26.04,66.67 26.04,61.59 26.04,50.16 25.4,49.53 24.98,49.53 | X6.8 90.81,23.75 93.73,20.83 93.73,10.41 92.2,8.89 JP1.2
  Top 1.27: 24.98,45.72 24.98,49.53 C4.1 | 24.98,45.72 24.98,41.73 24.34,41.09 23.5,41.09 IC4.3 | 24.98,45.72 v27.3,45.72 | v76.2,8.89 JP1.2
  Bottom 0.406: v39.37,52.07 34.04,44.83
  Bottom 1.27: v27.3,45.72 27.94,45.09 34.04,44.83 74.93,9.53 v76.2,8.89
VDD
  Top 0.61: R6.2 R1.2 78.42,63.81 78.11,63.5
  Top 1.016: 46.99,64.77 30.48,64.77 30.48,59.69 31.11,59.05 | J1.+5V 78.11,59.05 76.2,60.96 | J2.+5V 62.23,59.05 62.23,63.5 62.87,63.5 | 31.11,59.05 J4.+5V | J3.+5V 46.99,59.05 46.99,64.77 | 31.11,59.05 30.02,57.95 IC3.3 | 62.87,63.5 73.66,63.5 76.2,60.96 | 46.99,64.77 61.59,64.77 62.87,63.5 | 78.11,63.5 78.11,62.87 76.2,60.96
  Top 1.27: IC4.2 25.39,37.95 D3.C C8.1 30.02,36.93 IC3.3
VUSB
  Top 0.406: 10.79,41.91 10.79,39.7 10.16,39.06 X2.1 | 10.79,45.72 11.43,46.35 15.88,46.35 19.68,42.55 19.68,26.67 20.32,26.04 44.45,26.04 45.09,26.67 45.09,33.02 45.72,33.66 58.42,33.66 59.05,34.29 59.05,39.28 IC1.2 59.03,40.74 59.69,41.91 62.23,41.91 63.03,40.6 IC1.7
  Top 1.016: 10.79,41.91 10.79,45.72 10.79,46.35 9.53,47.62 D1.A
XTAL1
  Top 0.406: IC1.16 71.22,44.28 R12.1 72.33,43.18 74.17,43.18 X1.P$1 76.19,41.16 C1.2

### Text on the board
bNames: 1 | BLK
tValues: GND | + | I2C_2 | I2C_3 | I2C_4 | I2C_1 | GND | A3 | A2 | A1 | A0 | D5 | 3.3V | VBAT1 | D10 | D11 | SIM800L | D7
tDocu: BeeMoS I2C master v1.0
bDocu: BeeMoS I2C master v1.0